# EAGLE schematic robot_PI4_F28379D (EAGLE 7.7.0)

## Sheet 1 of 6
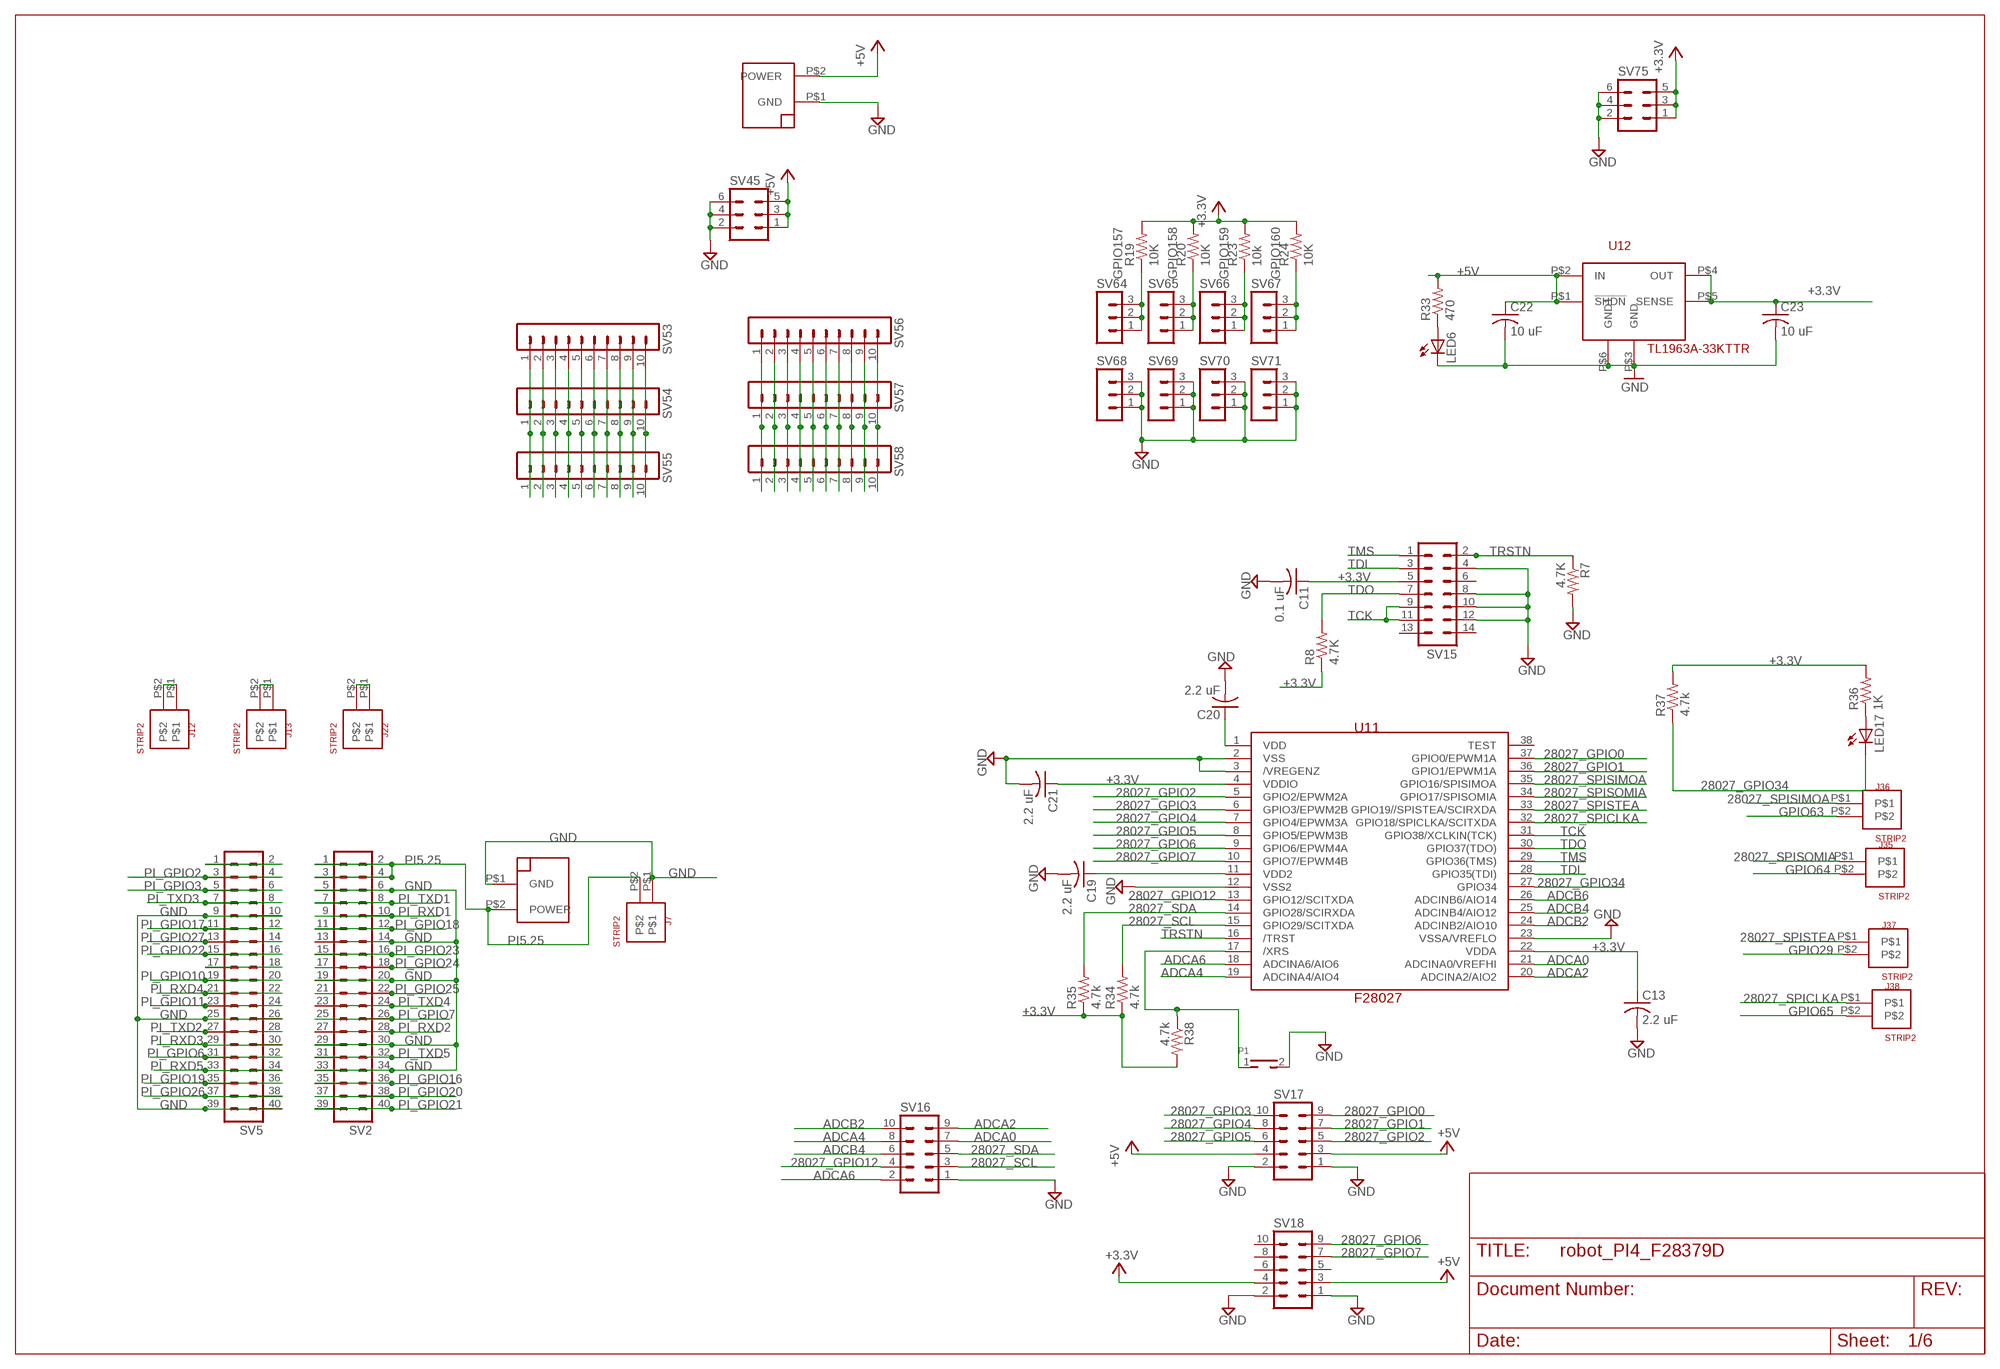
[diagram p0: schematic, sheet 1]

### Parts
C11  0.1 uF  C-USC1206  [C1206]
C13  2.2 uF  C-USC1206  [C1206]
C19  2.2 uF  C-USC1206  [C1206]
C20  2.2 uF  C-USC1206  [C1206]
C21  2.2 uF  C-USC1206  [C1206]
C22  10 uF  C-USC1206  [C1206]
C23  10 uF  C-USC1206  [C1206]
J7  STRIP2  [STRIP2]
J12  STRIP2  [STRIP2]
J13  STRIP2  [STRIP2]
J22  STRIP2  [STRIP2]
J35  STRIP2  [STRIP2]
J36  STRIP2  [STRIP2]
J37  STRIP2  [STRIP2]
J38  STRIP2  [STRIP2]
LED6  LEDCHIPLED_1206  [CHIPLED_1206]
LED17  LEDCHIPLED_1206  [CHIPLED_1206]
P1  TH_PUSHBOTTON  [TH_PUSHBUTTON]
P2  MOLEX_POWER  [MOLEX_POWER]
P3  MOLEX_POWER  [MOLEX_POWER]
R7  4.7K  R-US_M1206  [M1206]
R8  4.7K  R-US_M1206  [M1206]
R19  10K  R-US_M1206  [M1206]
R20  10K  R-US_M1206  [M1206]
R23  10k  R-US_M1206  [M1206]
R24  10K  R-US_M1206  [M1206]
R33  470  R-US_M1206  [M1206]
R34  4.7k  R-US_M1206  [M1206]
R35  4.7k  R-US_M1206  [M1206]
R36  1K  R-US_M1206  [M1206]
R37  4.7k  R-US_M1206  [M1206]
R38  4.7k  R-US_M1206  [M1206]
SV2  MA20-2  [MA20-2]
SV5  MA20-2  [MA20-2]
SV15  MA07-2  [MA07-2]
SV16  MA05-2  [MA05-2]
SV17  MA05-2  [MA05-2]
SV18  MA05-2  [MA05-2]
SV45  MA03-2  [MA03-2]
SV53  MA10-1  [MA10-1]
SV54  MA10-1  [MA10-1]
SV55  MA10-1  [MA10-1]
SV56  MA10-1  [MA10-1]
SV57  MA10-1  [MA10-1]
SV58  MA10-1  [MA10-1]
SV64  MA03-1  [MA03-1]
SV65  MA03-1  [MA03-1]
SV66  MA03-1  [MA03-1]
SV67  MA03-1  [MA03-1]
SV68  MA03-1  [MA03-1]
SV69  MA03-1  [MA03-1]
SV70  MA03-1  [MA03-1]
SV71  MA03-1  [MA03-1]
SV75  MA03-2  [MA03-2]
U11  F28027  TMS320F28027DAS  [DA38]
U12  TL1963A-33KTTR  [TL1963AKTTR]

### Nets
28027_GPIO0: SV17.9 U11.37(GPIO0/EPWM1A)
28027_GPIO1: SV17.7 U11.36(GPIO1/EPWM1A)
28027_GPIO2: SV17.5 U11.5(GPIO2/EPWM2A)
28027_GPIO3: SV17.10 U11.6(GPIO3/EPWM2B)
28027_GPIO4: SV17.8 U11.7(GPIO4/EPWM3A)
28027_GPIO5: SV17.6 U11.8(GPIO5/EPWM3B)
28027_GPIO6: SV18.9 U11.9(GPIO6/EPWM4A)
28027_GPIO7: SV18.7 U11.10(GPIO7/EPWM4B)
28027_GPIO12: SV16.4 U11.13(GPIO12/SCITXDA)
28027_GPIO34: LED17.C R37.1 U11.27(GPIO34)
28027_SCL: R34.2 SV16.3 U11.15(GPIO29/SCITXDA)
28027_SDA: R35.2 SV16.5 U11.14(GPIO28/SCIRXDA)
28027_SPICLKA: J38.P$1 U11.32(GPIO18/SPICLKA/SCITXDA)
28027_SPISIMOA: J36.P$1 U11.35(GPIO16/SPISIMOA)
28027_SPISOMIA: J35.P$1 U11.34(GPIO17/SPISOMIA)
28027_SPISTEA: J37.P$1 U11.33(GPIO19//SPISTEA/SCIRXDA)
+3.3V [supply]: C11.1 C13.1 C21.1 C23.1 R8.1 R19.2 R20.2 R23.2 R24.2 R34.1 R35.1 R36.2 R37.2 R38.2 SV15.5 SV18.4 SV75.1 SV75.3 SV75.5 U11.4(VDDIO) U11.22(VDDA) U12.P$4(OUT) U12.P$5(SENSE) ; also sheet 2,3,4,5,6
+5V [supply]: C22.1 P3.P$2(POWER) R33.2 SV17.3 SV17.4 SV18.3 SV45.1 SV45.3 SV45.5 U12.P$1(!SHDN) U12.P$2(IN) ; also sheet 4,5,6
ADCA0: SV16.7 U11.21(ADCINA0/VREFHI)
ADCA2: SV16.9 U11.20(ADCINA2/AIO2)
ADCA4: SV16.8 U11.19(ADCINA4/AIO4)
ADCA6: SV16.2 U11.18(ADCINA6/AIO6)
ADCB2: SV16.10 U11.24(ADCINB2/AIO10)
ADCB4: SV16.6 U11.25(ADCINB4/AIO12)
ADCB6: U11.26(ADCINB6/AIO14)
GND [supply]: C11.2 C13.2 C19.2 C20.2 C21.2 C22.2 C23.2 J7.P$1 LED6.C P1.2 P2.P$1(GND) P3.P$1(GND) R7.2 SV2.5 SV2.6 SV2.13 SV2.14 SV2.19 SV2.20 SV2.29 SV2.30 SV2.33 SV2.34 SV5.9 SV5.10 SV5.25 SV5.26 SV5.39 SV5.40 SV15.4 SV15.8 SV15.10 SV15.12 SV16.1 SV17.1 SV17.2 SV18.1 SV18.2 SV45.2 SV45.4 SV45.6 SV68.1 SV68.2 SV68.3 SV69.1 SV69.2 SV69.3 SV70.1 SV70.2 SV70.3 SV71.1 SV71.2 SV71.3 SV75.2 SV75.4 SV75.6 U11.2(VSS) U11.3(/VREGENZ) U11.12(VSS2) U11.23(VSSA/VREFLO) U12.P$3(GND) U12.P$6(GND1) ; also sheet 2,3,4,5,6
GPIO29: J37.P$2 ; also sheet 4
GPIO63: J36.P$2 ; also sheet 4,5,6
GPIO64: J35.P$2 ; also sheet 4,5,6
GPIO65: J38.P$2 ; also sheet 4,5,6
GPIO157: R19.1 SV64.1 SV64.2 SV64.3 ; also sheet 4
GPIO158: R20.1 SV65.1 SV65.2 SV65.3 ; also sheet 4
GPIO159: R23.1 SV66.1 SV66.2 SV66.3 ; also sheet 4
GPIO160: R24.1 SV67.1 SV67.2 SV67.3 ; also sheet 4
N$30 [supply]: SV5.1 SV5.2
N$38 [supply]: SV5.17 SV5.18
N$57: LED6.A R33.1
N$64 [supply]: J12.P$1 J12.P$2
N$65 [supply]: J13.P$1 J13.P$2
N$66 [supply]: J22.P$1 J22.P$2
N$67: SV53.1 SV54.1 SV55.1
N$69: SV53.2 SV54.2 SV55.2
N$73: SV53.3 SV54.3 SV55.3
N$77: SV53.4 SV54.4 SV55.4
N$78: SV53.5 SV54.5 SV55.5
N$79: SV53.6 SV54.6 SV55.6
N$80: SV53.7 SV54.7 SV55.7
N$81: SV53.8 SV54.8 SV55.8
N$82: SV53.9 SV54.9 SV55.9
N$83: SV53.10 SV54.10 SV55.10
N$84: SV56.1 SV57.1 SV58.1
N$85: SV56.2 SV57.2 SV58.2
N$86: SV56.3 SV57.3 SV58.3
N$87: SV56.4 SV57.4 SV58.4
N$88: SV56.5 SV57.5 SV58.5
N$89: SV56.6 SV57.6 SV58.6
N$90: SV56.7 SV57.7 SV58.7
N$91: SV56.8 SV57.8 SV58.8
N$92: SV56.9 SV57.9 SV58.9
N$93: SV56.10 SV57.10 SV58.10
N$103: C20.1 U11.1(VDD)
N$104: C19.1 U11.11(VDD2)
N$105: P1.1 R38.1 U11.17(/XRS)
N$106: LED17.A R36.1
PI5.25 [supply]: J7.P$2 P2.P$2(POWER) SV2.1 SV2.2 SV2.3 SV2.4
PI_GPIO2: SV5.3 SV5.4 ; also sheet 3
PI_GPIO3: SV5.5 SV5.6 ; also sheet 3
PI_GPIO6: SV5.31 SV5.32 ; also sheet 3
PI_GPIO7: SV2.25 SV2.26 ; also sheet 3
PI_GPIO10: SV5.19 SV5.20 ; also sheet 3
PI_GPIO11: SV5.23 SV5.24 ; also sheet 3
PI_GPIO16: SV2.35 SV2.36
PI_GPIO17: SV5.11 SV5.12
PI_GPIO18: SV2.11 SV2.12
PI_GPIO19: SV5.35 SV5.36
PI_GPIO20: SV2.37 SV2.38
PI_GPIO21: SV2.39 SV2.40
PI_GPIO22: SV5.15 SV5.16
PI_GPIO23: SV2.15 SV2.16
PI_GPIO24: SV2.17 SV2.18
PI_GPIO25: SV2.21 SV2.22
PI_GPIO26: SV5.37 SV5.38
PI_GPIO27: SV5.13 SV5.14
PI_RXD1: SV2.9 SV2.10 ; also sheet 3
PI_RXD2: SV2.27 SV2.28 ; also sheet 3
PI_RXD3: SV5.29 SV5.30 ; also sheet 3
PI_RXD4: SV5.21 SV5.22 ; also sheet 3
PI_RXD5: SV5.33 SV5.34 ; also sheet 3
PI_TXD1: SV2.7 SV2.8 ; also sheet 3
PI_TXD2: SV5.27 SV5.28 ; also sheet 3
PI_TXD3: SV5.7 SV5.8 ; also sheet 3
PI_TXD4: SV2.23 SV2.24 ; also sheet 3
PI_TXD5: SV2.31 SV2.32 ; also sheet 3
TCK: SV15.9 SV15.11 U11.31(GPIO38/XCLKIN(TCK))
TDI: SV15.3 U11.28(GPIO35(TDI))
TDO: R8.2 SV15.7 U11.30(GPIO37(TDO))
TMS: SV15.1 U11.29(GPIO36(TMS))
TRSTN: R7.1 SV15.2 U11.16(/TRST)
Unconnected: SV15.6 SV15.13 SV15.14 SV18.5 SV18.6 SV18.8 SV18.10 U11.38(TEST)

## Sheet 2 of 6
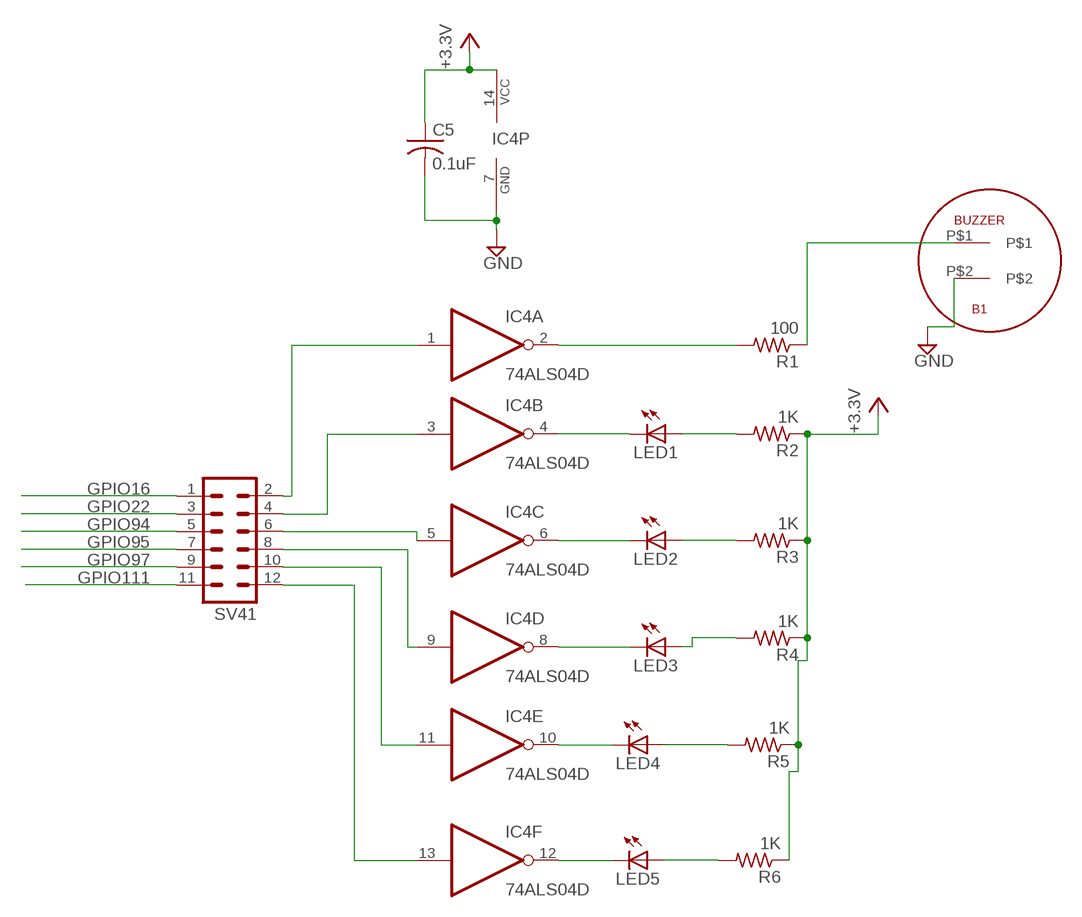
[diagram p1: schematic, sheet 2]

### Parts
B1  BUZZER  [BUZZER]
C5  0.1uF  C-USC0805  [C0805]
IC4  74ALS04D  [SO14]
LED1  LEDCHIPLED_1206  [CHIPLED_1206]
LED2  LEDCHIPLED_1206  [CHIPLED_1206]
LED3  LEDCHIPLED_1206  [CHIPLED_1206]
LED4  LEDCHIPLED_1206  [CHIPLED_1206]
LED5  LEDCHIPLED_1206  [CHIPLED_1206]
R1  100  R-US_R1206  [R1206]
R2  1K  R-US_R1206  [R1206]
R3  1K  R-US_R1206  [R1206]
R4  1K  R-US_R1206  [R1206]
R5  1K  R-US_R1206  [R1206]
R6  1K  R-US_R1206  [R1206]
SV41  MA06-2  [MA06-2]

### Nets
+3.3V [supply]: C5.1 IC4.14(P:VCC) R2.1 R3.1 R4.1 R5.1 R6.1 ; also sheet 1,3,4,5,6
GND [supply]: B1.P$2 C5.2 IC4.7(P:GND) ; also sheet 1,3,4,5,6
GPIO16: SV41.1 ; also sheet 4
GPIO22: SV41.3 ; also sheet 4
GPIO94: SV41.5 ; also sheet 4
GPIO95: SV41.7 ; also sheet 4
GPIO97: SV41.9 ; also sheet 4
GPIO111: SV41.11 ; also sheet 4
N$1: IC4.2(A:O) R1.2
N$2: IC4.4(B:O) LED1.C
N$3: B1.P$1 R1.1
N$4: LED1.A R2.2
N$5: LED2.A R3.2
N$6: LED3.A R4.2
N$7: LED4.A R5.2
N$8: LED5.A R6.2
N$9: IC4.12(F:O) LED5.C
N$10: IC4.10(E:O) LED4.C
N$11: IC4.8(D:O) LED3.C
N$12: IC4.6(C:O) LED2.C
N$13: IC4.1(A:I) SV41.2
N$14: IC4.3(B:I) SV41.4
N$15: IC4.5(C:I) SV41.6
N$16: IC4.9(D:I) SV41.8
N$17: IC4.11(E:I) SV41.10
N$18: IC4.13(F:I) SV41.12

## Sheet 3 of 6
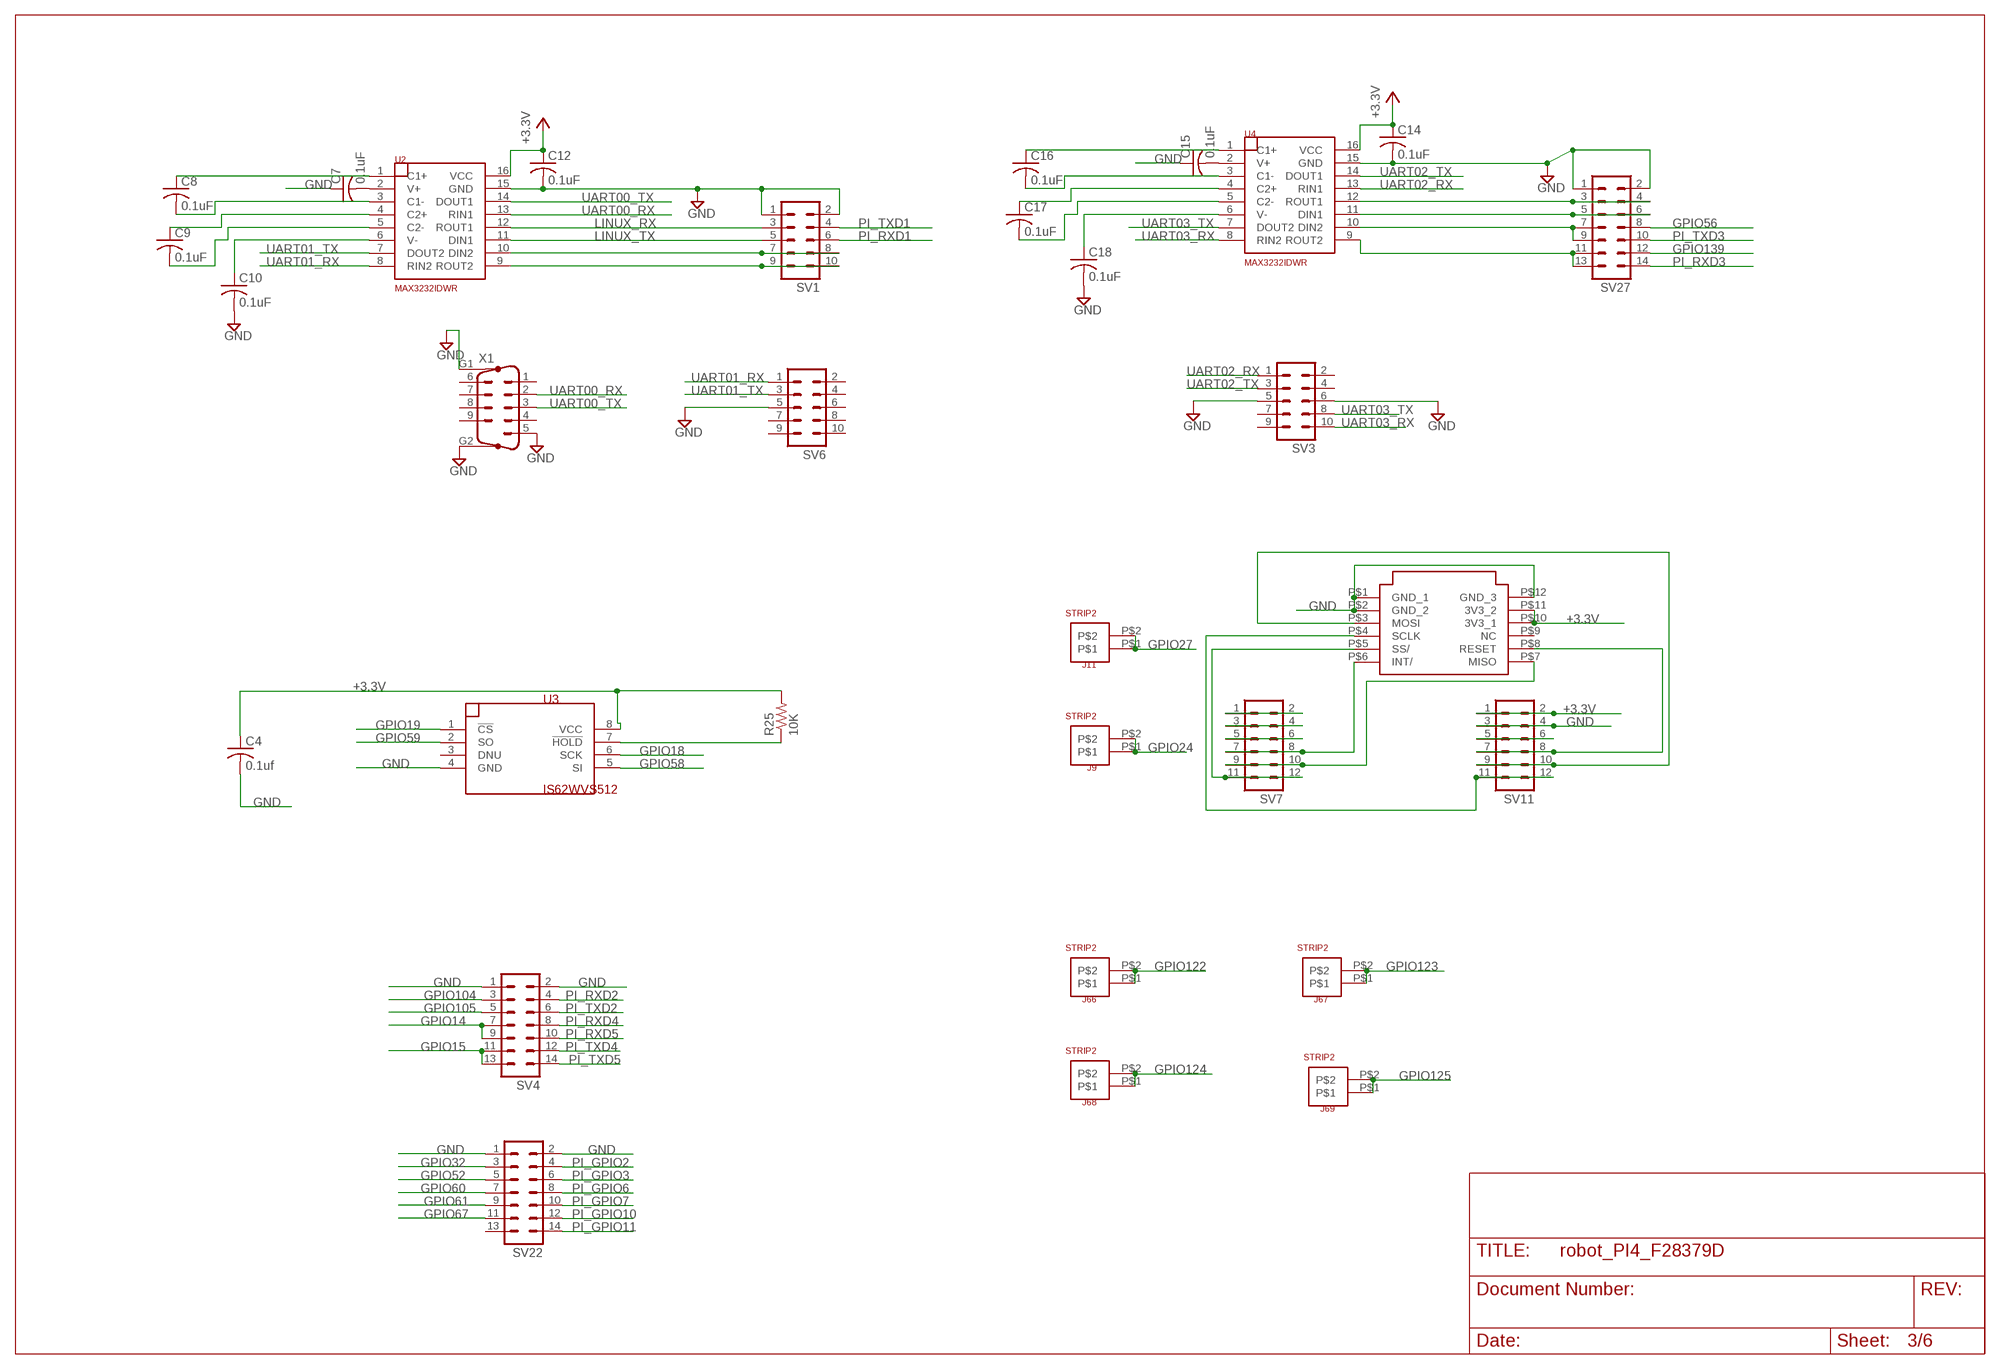
[diagram p2: schematic, sheet 3]

### Parts
C4  0.1uf  C-USC1206  [C1206]
C7  0.1uF  C-USC0805K  [C0805K]
C8  0.1uF  C-USC0805K  [C0805K]
C9  0.1uF  C-USC0805K  [C0805K]
C10  0.1uF  C-USC0805K  [C0805K]
C12  0.1uF  C-USC0805K  [C0805K]
C14  0.1uF  C-USC0805K  [C0805K]
C15  0.1uF  C-USC0805K  [C0805K]
C16  0.1uF  C-USC0805K  [C0805K]
C17  0.1uF  C-USC0805K  [C0805K]
C18  0.1uF  C-USC0805K  [C0805K]
ETH1  USR_ES1_W5500  [USR_ES1_W5500]
J9  STRIP2  [STRIP2]
J11  STRIP2  [STRIP2]
J66  STRIP2  [STRIP2]
J67  STRIP2  [STRIP2]
J68  STRIP2  [STRIP2]
J69  STRIP2  [STRIP2]
R25  10K  R-US_M1206  [M1206]
SV1  MA05-2  [MA05-2]
SV3  MA05-2  [MA05-2]
SV4  MA07-2  [MA07-2]
SV6  MA05-2  [MA05-2]
SV7  MA06-2  [MA06-2]
SV11  MA06-2  [MA06-2]
SV22  MA07-2  [MA07-2]
SV27  MA07-2  [MA07-2]
U2  MAX3232IDWR  [SO16W]
U3  IS62WVS512  [SO08]
U4  MAX3232IDWR  [SO16W]
X1  M09HP  [M09HP]

### Nets
+3.3V [supply]: C4.1 C12.1 C14.1 ETH1.P$10(3V3_1) ETH1.P$11(3V3_2) R25.2 SV11.1 SV11.2 U2.16(VCC) U3.8(VCC) U4.16(VCC) ; also sheet 1,2,4,5,6
GND [supply]: C4.2 C7.1 C10.2 C12.2 C14.2 C15.1 C18.2 ETH1.P$1(GND_1) ETH1.P$2(GND_2) ETH1.P$12(GND_3) SV1.1 SV1.2 SV3.5 SV3.6 SV4.1 SV4.2 SV6.5 SV11.3 SV11.4 SV22.1 SV22.2 SV27.1 SV27.2 U2.15(GND) U3.4(GND) U4.15(GND) X1.5 X1.G1 X1.G2 ; also sheet 1,2,4,5,6
GPIO14: SV4.7 SV4.9 ; also sheet 4
GPIO15: SV4.11 SV4.13 ; also sheet 4
GPIO18: U3.6(SCK) ; also sheet 4
GPIO19: U3.1(!CS) ; also sheet 4
GPIO24: J9.P$1 J9.P$2 ; also sheet 4
GPIO27: J11.P$1 J11.P$2 ; also sheet 4
GPIO32: SV22.3 ; also sheet 4
GPIO52: SV22.5 ; also sheet 4
GPIO56: SV27.8 ; also sheet 4
GPIO58: U3.5(SI) ; also sheet 4
GPIO59: U3.2(SO) ; also sheet 4
GPIO60: SV22.7 ; also sheet 4
GPIO61: SV22.9 ; also sheet 4
GPIO67: SV22.11 ; also sheet 4
GPIO104: SV4.3 ; also sheet 4
GPIO105: SV4.5 ; also sheet 4
GPIO122: J66.P$1 J66.P$2 ; also sheet 4
GPIO123: J67.P$1 J67.P$2 ; also sheet 4
GPIO124: J68.P$1 J68.P$2 ; also sheet 4
GPIO125: J69.P$1 J69.P$2 ; also sheet 4
GPIO139: SV27.12 ; also sheet 4
LINUX_RX: SV1.3 U2.12(ROUT1)
LINUX_TX: SV1.5 U2.11(DIN1)
N$19: SV1.7 SV1.8 U2.10(DIN2)
N$20: C7.2 U2.2(V+)
N$21: C16.1 U4.1(C1+)
N$22: C16.2 U4.3(C1-)
N$23: C17.1 U4.4(C2+)
N$24: C17.2 U4.5(C2-)
N$25: SV1.9 SV1.10 U2.9(ROUT2)
N$26: C18.1 U4.6(V-)
N$27: C15.2 U4.2(V+)
N$32: SV27.11 SV27.13 U4.9(ROUT2)
N$58: SV27.3 SV27.4 U4.12(ROUT1)
N$59: SV27.5 SV27.6 U4.11(DIN1)
N$60: SV27.7 SV27.9 U4.10(DIN2)
N$71: C8.1 U2.1(C1+)
N$72: C8.2 U2.3(C1-)
N$74: C9.1 U2.4(C2+)
N$75: C9.2 U2.5(C2-)
N$76: C10.1 U2.6(V-)
N$94: R25.1 U3.7(!HOLD)
N$95: SV7.1 SV7.2
N$96: SV7.3 SV7.4
N$97: SV7.5 SV7.6
N$98: ETH1.P$6(INT/) SV7.7 SV7.8
N$121: ETH1.P$7(MISO) SV7.9 SV7.10
N$135: ETH1.P$5(SS/) SV7.11 SV7.12
N$146: SV11.5 SV11.6
N$149: ETH1.P$8(RESET) SV11.7 SV11.8
N$154: ETH1.P$3(MOSI) SV11.9 SV11.10
N$155: ETH1.P$4(SCLK) SV11.11 SV11.12
PI_GPIO2: SV22.4 ; also sheet 1
PI_GPIO3: SV22.6 ; also sheet 1
PI_GPIO6: SV22.8 ; also sheet 1
PI_GPIO7: SV22.10 ; also sheet 1
PI_GPIO10: SV22.12 ; also sheet 1
PI_GPIO11: SV22.14 ; also sheet 1
PI_RXD1: SV1.6 ; also sheet 1
PI_RXD2: SV4.4 ; also sheet 1
PI_RXD3: SV27.14 ; also sheet 1
PI_RXD4: SV4.8 ; also sheet 1
PI_RXD5: SV4.10 ; also sheet 1
PI_TXD1: SV1.4 ; also sheet 1
PI_TXD2: SV4.6 ; also sheet 1
PI_TXD3: SV27.10 ; also sheet 1
PI_TXD4: SV4.12 ; also sheet 1
PI_TXD5: SV4.14 ; also sheet 1
UART00_RX: U2.13(RIN1) X1.2
UART00_TX: U2.14(DOUT1) X1.3
UART01_RX: SV6.1 U2.8(RIN2)
UART01_TX: SV6.3 U2.7(DOUT2)
UART02_RX: SV3.1 U4.13(RIN1)
UART02_TX: SV3.3 U4.14(DOUT1)
UART03_RX: SV3.10 U4.8(RIN2)
UART03_TX: SV3.8 U4.7(DOUT2)
Unconnected: ETH1.P$9(NC) SV3.2 SV3.4 SV3.7 SV3.9 SV6.2 SV6.4 SV6.6 SV6.7 SV6.8 SV6.9 SV6.10 SV22.13 U3.3(DNU) X1.1 X1.4 X1.6 X1.7 X1.8 X1.9

## Sheet 4 of 6
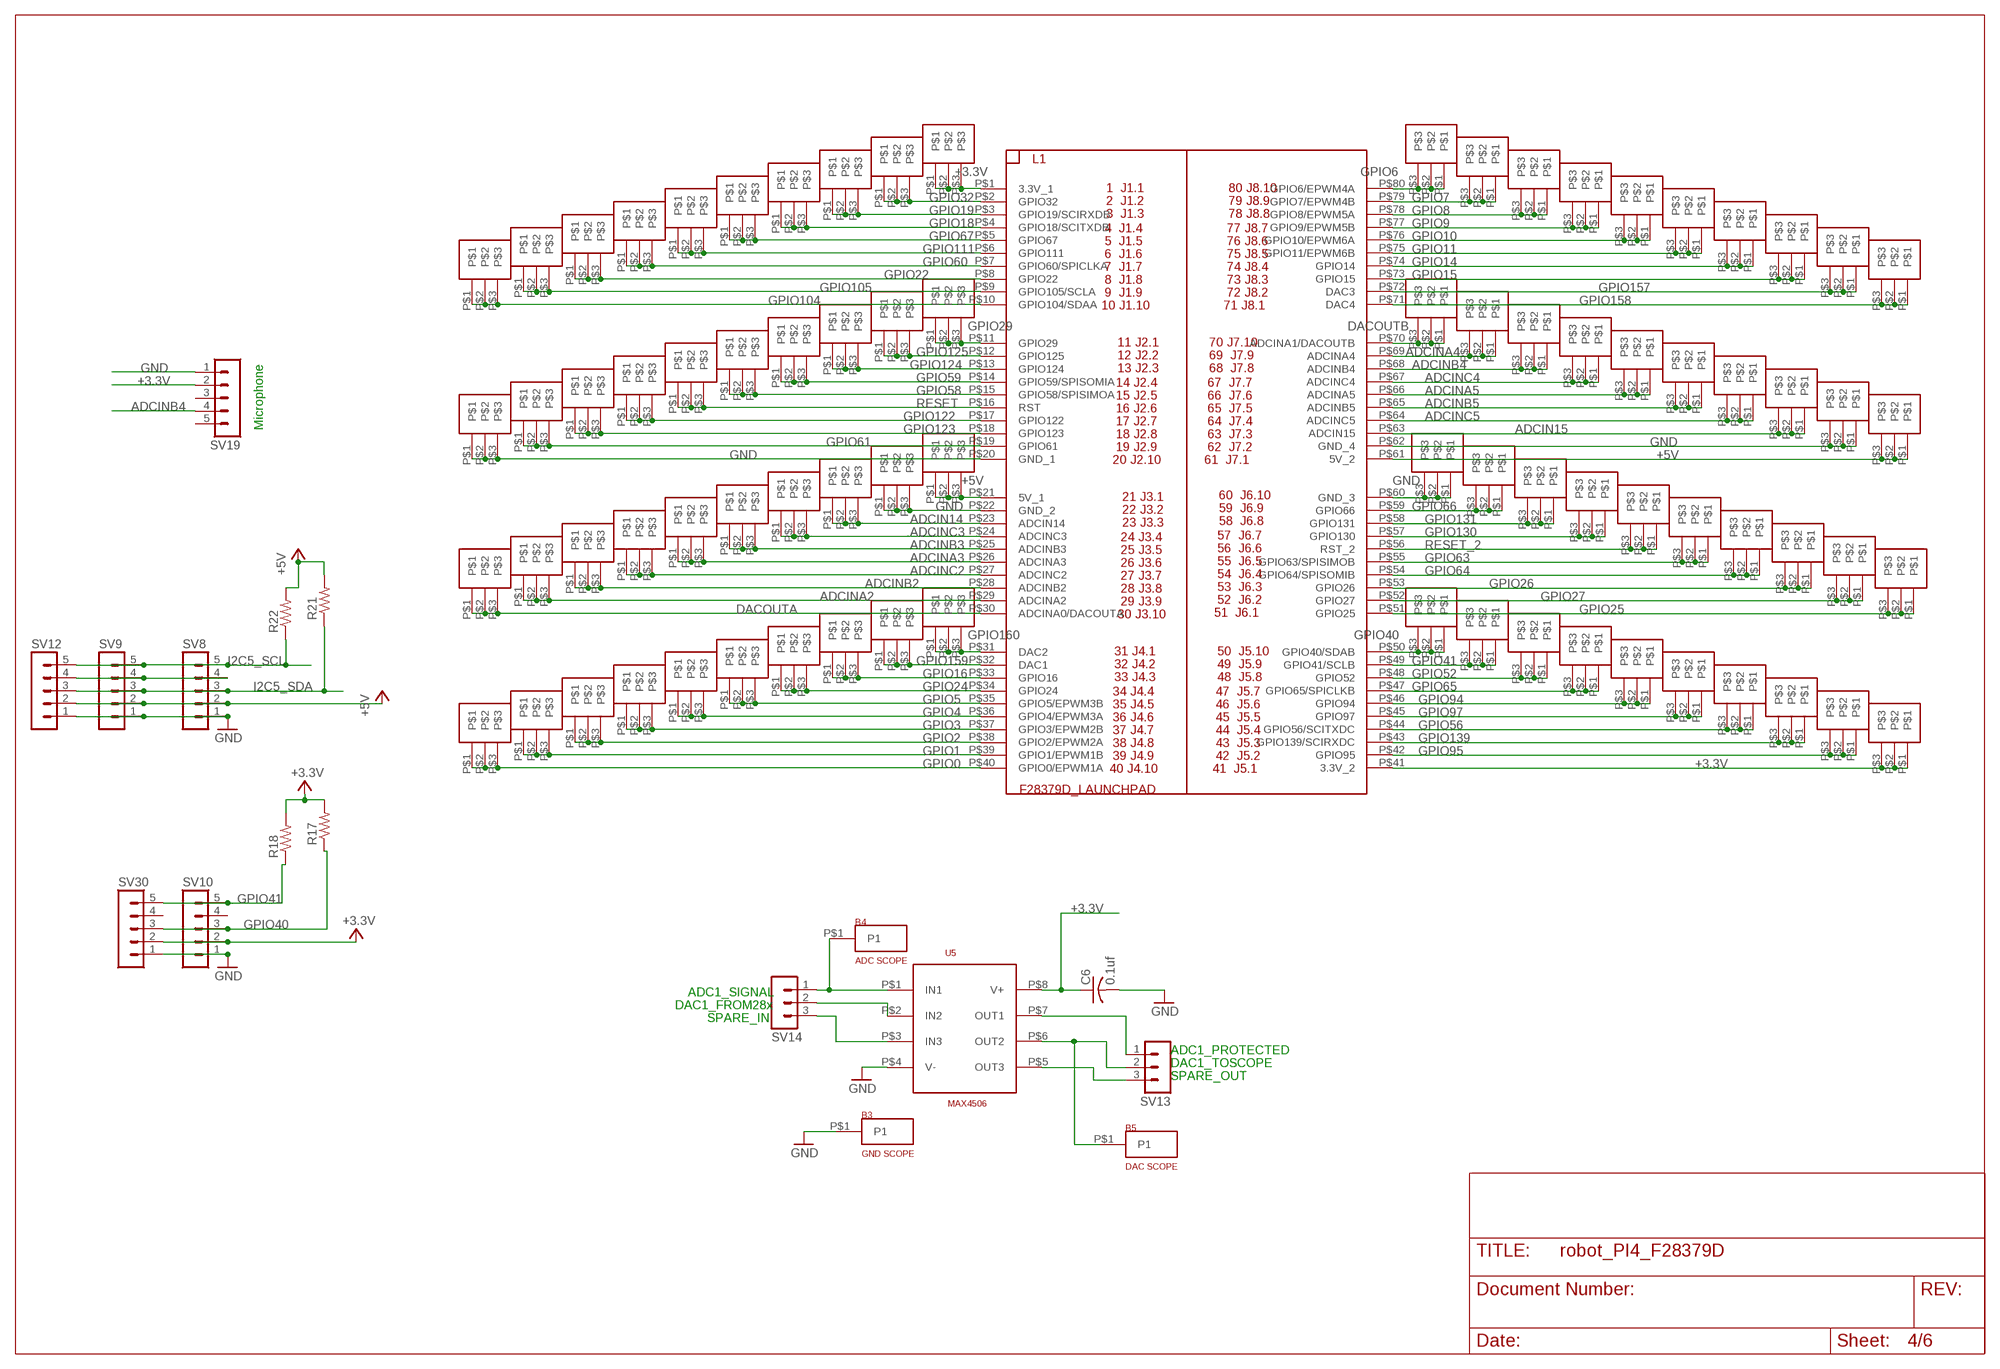
[diagram p3: schematic, sheet 4]

### Parts
B3  GND SCOPE  BANANA_MALE  [BANANA_MALE]
B4  ADC SCOPE  BANANA_MALE  [BANANA_MALE]
B5  DAC SCOPE  BANANA_MALE  [BANANA_MALE]
C6  0.1uf  C-USC1206  [C1206]
J10  STRIP3  [STRIP3]
J14  STRIP3  [STRIP3]
J15  STRIP3  [STRIP3]
J16  STRIP3  [STRIP3]
J17  STRIP3  [STRIP3]
J18  STRIP3  [STRIP3]
J19  STRIP3  [STRIP3]
J20  STRIP3  [STRIP3]
J21  STRIP3  [STRIP3]
J28  STRIP3  [STRIP3]
J29  STRIP3  [STRIP3]
J30  STRIP3  [STRIP3]
J31  STRIP3  [STRIP3]
J32  STRIP3  [STRIP3]
J33  STRIP3  [STRIP3]
J98  STRIP3  [STRIP3]
J99  STRIP3  [STRIP3]
J100  STRIP3  [STRIP3]
J101  STRIP3  [STRIP3]
J102  STRIP3  [STRIP3]
J103  STRIP3  [STRIP3]
J104  STRIP3  [STRIP3]
J105  STRIP3  [STRIP3]
J106  STRIP3  [STRIP3]
J107  STRIP3  [STRIP3]
J108  STRIP3  [STRIP3]
J109  STRIP3  [STRIP3]
J110  STRIP3  [STRIP3]
J111  STRIP3  [STRIP3]
J112  STRIP3  [STRIP3]
J113  STRIP3  [STRIP3]
J114  STRIP3  [STRIP3]
J115  STRIP3  [STRIP3]
J116  STRIP3  [STRIP3]
J117  STRIP3  [STRIP3]
J118  STRIP3  [STRIP3]
J119  STRIP3  [STRIP3]
J120  STRIP3  [STRIP3]
J121  STRIP3  [STRIP3]
J122  STRIP3  [STRIP3]
J133  STRIP3  [STRIP3]
J134  STRIP3  [STRIP3]
J135  STRIP3  [STRIP3]
J136  STRIP3  [STRIP3]
J137  STRIP3  [STRIP3]
J138  STRIP3  [STRIP3]
J139  STRIP3  [STRIP3]
J140  STRIP3  [STRIP3]
J141  STRIP3  [STRIP3]
J142  STRIP3  [STRIP3]
J143  STRIP3  [STRIP3]
J144  STRIP3  [STRIP3]
J145  STRIP3  [STRIP3]
J146  STRIP3  [STRIP3]
J147  STRIP3  [STRIP3]
J148  STRIP3  [STRIP3]
J149  STRIP3  [STRIP3]
J150  STRIP3  [STRIP3]
J151  STRIP3  [STRIP3]
J152  STRIP3  [STRIP3]
J153  STRIP3  [STRIP3]
J154  STRIP3  [STRIP3]
J155  STRIP3  [STRIP3]
J156  STRIP3  [STRIP3]
J157  STRIP3  [STRIP3]
J158  STRIP3  [STRIP3]
J159  STRIP3  [STRIP3]
J160  STRIP3  [STRIP3]
J161  STRIP3  [STRIP3]
J162  STRIP3  [STRIP3]
J163  STRIP3  [STRIP3]
J164  STRIP3  [STRIP3]
J165  STRIP3  [STRIP3]
J166  STRIP3  [STRIP3]
J167  STRIP3  [STRIP3]
J168  STRIP3  [STRIP3]
J169  STRIP3  [STRIP3]
J170  STRIP3  [STRIP3]
J176  STRIP3  [STRIP3]
J177  STRIP3  [STRIP3]
L1  F28379D_LAUNCHPAD  [F28379D_LAUNCHPAD]
R17  R-US_R1206  [R1206]
R18  R-US_R1206  [R1206]
R21  R-US_R1206  [R1206]
R22  R-US_R1206  [R1206]
SV8  MA05-1  [MA05-1]
SV9  MA05-1  [MA05-1]
SV10  MA05-1  [MA05-1]
SV12  MA05-1  [MA05-1]
SV13  MA03-1  [MA03-1]
SV14  MA03-1  [MA03-1]
SV19  MA05-1  [MA05-1]
SV30  MA05-1  [MA05-1]
U5  MAX4506  MAX4506-SOIC8  [SOIC-8]

### Nets
+3.3V [supply]: C6.1 J10.P$1 J10.P$2 J10.P$3 J177.P$1 J177.P$2 J177.P$3 L1.P$1(3.3V_1) L1.P$41(3.3V_2) R17.2 R18.2 SV10.2 SV19.2 SV30.2 U5.P$8(V+) ; also sheet 1,2,3,5,6
+5V [supply]: J103.P$1 J103.P$2 J103.P$3 J152.P$1 J152.P$2 J152.P$3 L1.P$21(5V_1) L1.P$61(5V_2) R21.2 R22.2 SV8.2 SV9.2 SV12.2 ; also sheet 1,5,6
ADCIN14: J105.P$1 J105.P$2 J105.P$3 L1.P$23(ADCIN14)
ADCIN15: J150.P$1 J150.P$2 J150.P$3 L1.P$63(ADCIN15)
ADCINA2: J111.P$1 J111.P$2 J111.P$3 L1.P$29(ADCINA2)
ADCINA3: J108.P$1 J108.P$2 J108.P$3 L1.P$26(ADCINA3)
ADCINA4: J144.P$1 J144.P$2 J144.P$3 L1.P$69(ADCINA4)
ADCINA5: J147.P$1 J147.P$2 J147.P$3 L1.P$66(ADCINA5)
ADCINB2: J110.P$1 J110.P$2 J110.P$3 L1.P$28(ADCINB2)
ADCINB3: J107.P$1 J107.P$2 J107.P$3 L1.P$25(ADCINB3)
ADCINB4: J145.P$1 J145.P$2 J145.P$3 L1.P$68(ADCINB4) SV19.4
ADCINB5: J148.P$1 J148.P$2 J148.P$3 L1.P$65(ADCINB5)
ADCINC2: J109.P$1 J109.P$2 J109.P$3 L1.P$27(ADCINC2) ; also sheet 5
ADCINC3: J106.P$1 J106.P$2 J106.P$3 L1.P$24(ADCINC3) ; also sheet 5
ADCINC4: J146.P$1 J146.P$2 J146.P$3 L1.P$67(ADCINC4) ; also sheet 5
ADCINC5: J149.P$1 J149.P$2 J149.P$3 L1.P$64(ADCINC5) ; also sheet 5
DACOUTA: J112.P$1 J112.P$2 J112.P$3 L1.P$30(ADCINA0/DACOUTA)
DACOUTB: J143.P$1 J143.P$2 J143.P$3 L1.P$70(ADCINA1/DACOUTB)
GND [supply]: B3.P$1(P1) C6.2 J102.P$1 J102.P$2 J102.P$3 J104.P$1 J104.P$2 J104.P$3 J151.P$1 J151.P$2 J151.P$3 J153.P$1 J153.P$2 J153.P$3 L1.P$20(GND_1) L1.P$22(GND_2) L1.P$60(GND_3) L1.P$62(GND_4) SV8.1 SV9.1 SV10.1 SV12.1 SV19.1 SV30.1 U5.P$4(V-) ; also sheet 1,2,3,5,6
GPIO0: J122.P$1 J122.P$2 J122.P$3 L1.P$40(GPIO0/EPWM1A) ; also sheet 6
GPIO1: J121.P$1 J121.P$2 J121.P$3 L1.P$39(GPIO1/EPWM1B) ; also sheet 6
GPIO2: J120.P$1 J120.P$2 J120.P$3 L1.P$38(GPIO2/EPWM2A) ; also sheet 6
GPIO3: J119.P$1 J119.P$2 J119.P$3 L1.P$37(GPIO3/EPWM2B) ; also sheet 6
GPIO4: J118.P$1 J118.P$2 J118.P$3 L1.P$36(GPIO4/EPWM3A) ; also sheet 6
GPIO5: J117.P$1 J117.P$2 J117.P$3 L1.P$35(GPIO5/EPWM3B) ; also sheet 6
GPIO6: J133.P$1 J133.P$2 J133.P$3 L1.P$80(GPIO6/EPWM4A) ; also sheet 6
GPIO7: J134.P$1 J134.P$2 J134.P$3 L1.P$79(GPIO7/EPWM4B) ; also sheet 6
GPIO8: J135.P$1 J135.P$2 J135.P$3 L1.P$78(GPIO8/EPWM5A) ; also sheet 6
GPIO9: J136.P$1 J136.P$2 J136.P$3 L1.P$77(GPIO9/EPWM5B) ; also sheet 6
GPIO10: J137.P$1 J137.P$2 J137.P$3 L1.P$76(GPIO10/EPWM6A) ; also sheet 6
GPIO11: J138.P$1 J138.P$2 J138.P$3 L1.P$75(GPIO11/EPWM6B)
GPIO14: J139.P$1 J139.P$2 J139.P$3 L1.P$74(GPIO14) ; also sheet 3
GPIO15: J140.P$1 J140.P$2 J140.P$3 L1.P$73(GPIO15) ; also sheet 3
GPIO16: J115.P$1 J115.P$2 J115.P$3 L1.P$33(GPIO16) ; also sheet 2
GPIO18: J16.P$1 J16.P$2 J16.P$3 L1.P$4(GPIO18/SCITXDB) ; also sheet 3
GPIO19: J15.P$1 J15.P$2 J15.P$3 L1.P$3(GPIO19/SCIRXDB) ; also sheet 3
GPIO22: J20.P$1 J20.P$2 J20.P$3 L1.P$8(GPIO22) ; also sheet 2
GPIO24: J116.P$1 J116.P$2 J116.P$3 L1.P$34(GPIO24) ; also sheet 3
GPIO25: J162.P$1 J162.P$2 J162.P$3 L1.P$51(GPIO25) ; also sheet 6
GPIO26: J160.P$1 J160.P$2 J160.P$3 L1.P$53(GPIO26) ; also sheet 6
GPIO27: J161.P$1 J161.P$2 J161.P$3 L1.P$52(GPIO27) ; also sheet 3
GPIO29: J29.P$1 J29.P$2 J29.P$3 L1.P$11(GPIO29) ; also sheet 1
GPIO32: J14.P$1 J14.P$2 J14.P$3 L1.P$2(GPIO32) ; also sheet 3
GPIO40: J163.P$1 J163.P$2 J163.P$3 L1.P$50(GPIO40/SDAB) R17.1 SV10.3 SV30.3
GPIO41: J164.P$1 J164.P$2 J164.P$3 L1.P$49(GPIO41/SCLB) R18.1 SV10.5 SV30.5
GPIO52: J165.P$1 J165.P$2 J165.P$3 L1.P$48(GPIO52) ; also sheet 3
GPIO56: J169.P$1 J169.P$2 J169.P$3 L1.P$44(GPIO56/SCITXDC) ; also sheet 3
GPIO58: J33.P$1 J33.P$2 J33.P$3 L1.P$15(GPIO58/SPISIMOA) ; also sheet 3
GPIO59: J32.P$1 J32.P$2 J32.P$3 L1.P$14(GPIO59/SPISOMIA) ; also sheet 3
GPIO60: J19.P$1 J19.P$2 J19.P$3 L1.P$7(GPIO60/SPICLKA) ; also sheet 3
GPIO61: J101.P$1 J101.P$2 J101.P$3 L1.P$19(GPIO61) ; also sheet 3
GPIO63: J158.P$1 J158.P$2 J158.P$3 L1.P$55(GPIO63/SPISIMOB) ; also sheet 1,5,6
GPIO64: J159.P$1 J159.P$2 J159.P$3 L1.P$54(GPIO64/SPISOMIB) ; also sheet 1,5,6
GPIO65: J166.P$1 J166.P$2 J166.P$3 L1.P$47(GPIO65/SPICLKB) ; also sheet 1,5,6
GPIO66: J154.P$1 J154.P$2 J154.P$3 L1.P$59(GPIO66) ; also sheet 5
GPIO67: J17.P$1 J17.P$2 J17.P$3 L1.P$5(GPIO67) ; also sheet 3
GPIO94: J167.P$1 J167.P$2 J167.P$3 L1.P$46(GPIO94) ; also sheet 2
GPIO95: J176.P$1 J176.P$2 J176.P$3 L1.P$42(GPIO95) ; also sheet 2
GPIO97: J168.P$1 J168.P$2 J168.P$3 L1.P$45(GPIO97) ; also sheet 2
GPIO104: J28.P$1 J28.P$2 J28.P$3 L1.P$10(GPIO104/SDAA) ; also sheet 3
GPIO105: J21.P$1 J21.P$2 J21.P$3 L1.P$9(GPIO105/SCLA) ; also sheet 3
GPIO111: J18.P$1 J18.P$2 J18.P$3 L1.P$6(GPIO111) ; also sheet 2
GPIO122: J99.P$1 J99.P$2 J99.P$3 L1.P$17(GPIO122) ; also sheet 3
GPIO123: J100.P$1 J100.P$2 J100.P$3 L1.P$18(GPIO123) ; also sheet 3
GPIO124: J31.P$1 J31.P$2 J31.P$3 L1.P$13(GPIO124) ; also sheet 3
GPIO125: J30.P$1 J30.P$2 J30.P$3 L1.P$12(GPIO125) ; also sheet 3
GPIO130: J156.P$1 J156.P$2 J156.P$3 L1.P$57(GPIO130) ; also sheet 6
GPIO131: J155.P$1 J155.P$2 J155.P$3 L1.P$58(GPIO131) ; also sheet 6
GPIO139: J170.P$1 J170.P$2 J170.P$3 L1.P$43(GPIO139/SCIRXDC) ; also sheet 3
GPIO157: J141.P$1 J141.P$2 J141.P$3 L1.P$72(DAC3) ; also sheet 1
GPIO158: J142.P$1 J142.P$2 J142.P$3 L1.P$71(DAC4) ; also sheet 1
GPIO159: J114.P$1 J114.P$2 J114.P$3 L1.P$32(DAC1) ; also sheet 1
GPIO160: J113.P$1 J113.P$2 J113.P$3 L1.P$31(DAC2) ; also sheet 1
I2C5_SCL: R22.1 SV8.5 SV9.5 SV12.5
I2C5_SDA: R21.1 SV8.3 SV9.3 SV12.3
N$28: SV8.4 SV9.4 SV12.4
N$29: SV13.1 U5.P$7(OUT1)
N$31: B5.P$1(P1) SV13.2 U5.P$6(OUT2)
N$99: SV13.3 U5.P$5(OUT3)
N$100: B4.P$1(P1) SV14.1 U5.P$1(IN1)
N$101: SV14.2 U5.P$2(IN2)
N$102: SV14.3 U5.P$3(IN3)
RESET: J98.P$1 J98.P$2 J98.P$3 L1.P$16(RST)
RESET_2: J157.P$1 J157.P$2 J157.P$3 L1.P$56(RST_2)
Unconnected: SV10.4 SV19.3 SV19.5 SV30.4

### Notes on the sheet
- Microphone
- ADC1_SIGNAL
- DAC1_FROM28x
- SPARE_IN
- ADC1_PROTECTED
- DAC1_TOSCOPE
- SPARE_OUT

## Sheet 5 of 6
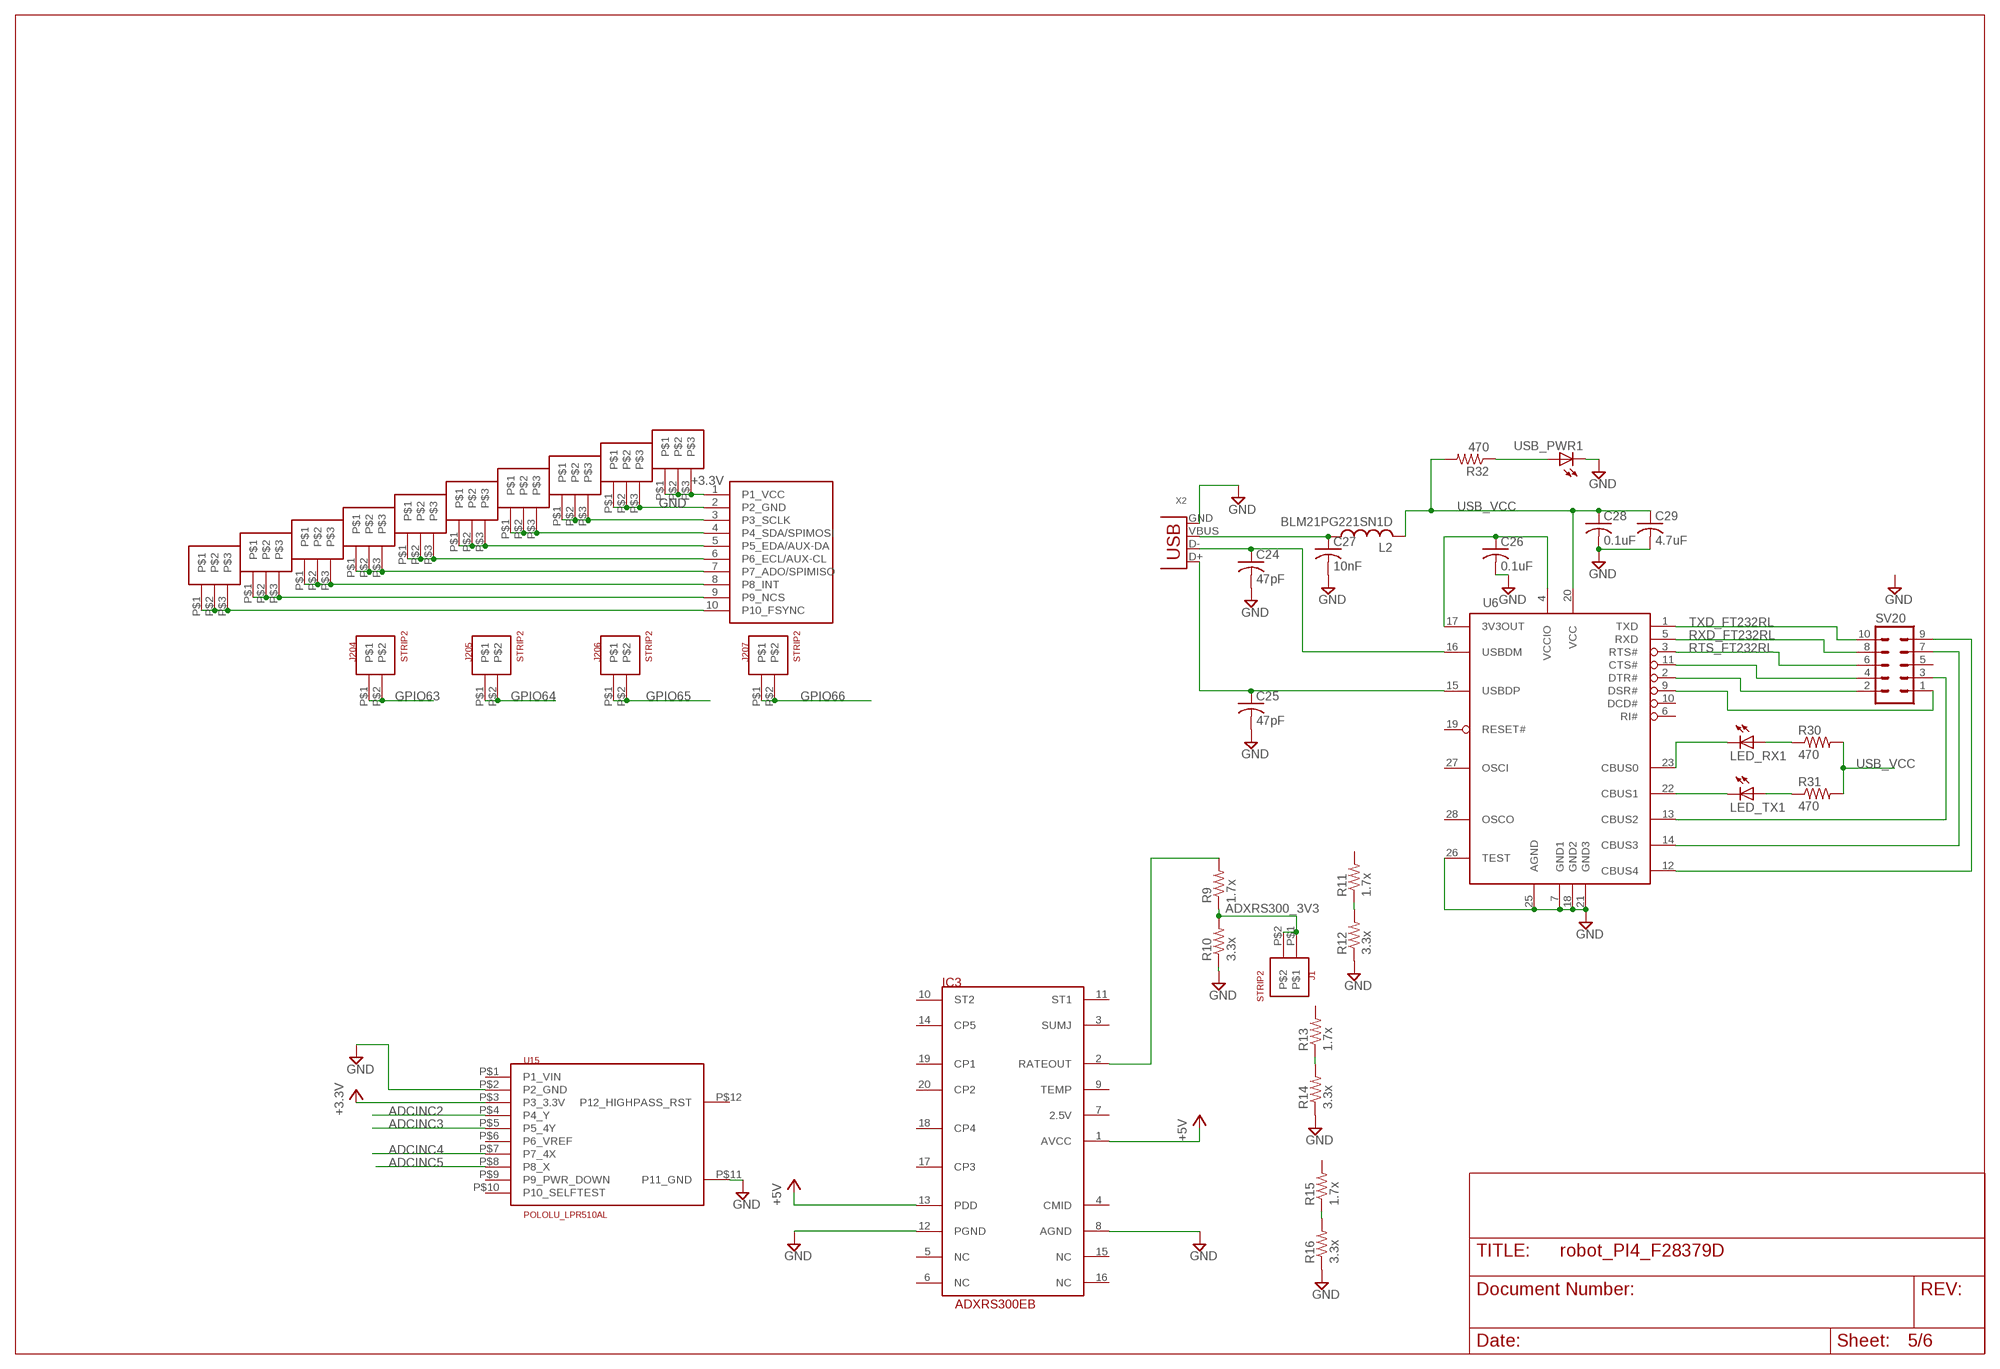
[diagram p4: schematic, sheet 5]

### Parts
C24  47pF  C-USC1206  [C1206]
C25  47pF  C-USC1206  [C1206]
C26  0.1uF  C-USC1206  [C1206]
C27  10nF  C-USC1206  [C1206]
C28  0.1uF  C-USC1206  [C1206]
C29  4.7uF  C-USC1206  [C1206]
IC3  ADXRS300EB  [DIL20]
J1  STRIP2  [STRIP2]
J123  STRIP3  [STRIP3]
J124  STRIP3  [STRIP3]
J125  STRIP3  [STRIP3]
J126  STRIP3  [STRIP3]
J127  STRIP3  [STRIP3]
J128  STRIP3  [STRIP3]
J129  STRIP3  [STRIP3]
J130  STRIP3  [STRIP3]
J131  STRIP3  [STRIP3]
J132  STRIP3  [STRIP3]
J204  STRIP2  [STRIP2]
J205  STRIP2  [STRIP2]
J206  STRIP2  [STRIP2]
J207  STRIP2  [STRIP2]
L2  BLM21PG221SN1D  L-USL0805  [L0805]
LED_RX1  LED3MM  [LED3MM]
LED_TX1  LED3MM  [LED3MM]
R9  1.7x  R-US_M1206  [M1206]
R10  3.3x  R-US_M1206  [M1206]
R11  1.7x  R-US_M1206  [M1206]
R12  3.3x  R-US_M1206  [M1206]
R13  1.7x  R-US_M1206  [M1206]
R14  3.3x  R-US_M1206  [M1206]
R15  1.7x  R-US_M1206  [M1206]
R16  3.3x  R-US_M1206  [M1206]
R30  470  R-US_M1206  [M1206]
R31  470  R-US_M1206  [M1206]
R32  470  R-US_M1206  [M1206]
SV20  MA05-2  [MA05-2]
U6  FT232RL  [SSOP28DB]
U15  POLOLU_LPR510AL  [POLOLU_LPR510AL]
U$1  MPU-9250-BB  [MPU-9250-BB]
USB_PWR1  LED3MM  [LED3MM]
X2  USB-B-H  [USB-B-H]

### Nets
+3.3V [supply]: J123.P$1 J123.P$2 J123.P$3 U15.P$3(P3_3.3V) U$1.1(P1_VCC) ; also sheet 1,2,3,4,6
+5V [supply]: IC3.1(AVCC) IC3.13(PDD) ; also sheet 1,4,6
ADCINC2: U15.P$4(P4_Y) ; also sheet 4
ADCINC3: U15.P$5(P5_4Y) ; also sheet 4
ADCINC4: U15.P$7(P7_4X) ; also sheet 4
ADCINC5: U15.P$8(P8_X) ; also sheet 4
ADXRS300_3V3: J1.P$1 J1.P$2 R9.1 R10.2
GND [supply]: C24.2 C25.2 C26.2 C27.2 C28.2 C29.2 IC3.8(AGND) IC3.12(PGND) J124.P$1 J124.P$2 J124.P$3 R10.1 R12.1 R14.1 R16.1 U6.7(GND1) U6.18(GND2) U6.21(GND3) U6.25(AGND) U6.26(TEST) U15.P$2(P2_GND) U15.P$11(P11_GND) U$1.2(P2_GND) USB_PWR1.K(C) X2.GND ; also sheet 1,2,3,4,6
GPIO63: J204.P$1 J204.P$2 ; also sheet 1,4,6
GPIO64: J205.P$1 J205.P$2 ; also sheet 1,4,6
GPIO65: J206.P$1 J206.P$2 ; also sheet 1,4,6
GPIO66: J207.P$1 J207.P$2 ; also sheet 4
N$39 [supply]: C27.1 L2.1 X2.VBUS
N$40: C24.1 U6.16(USBDM) X2.D-
N$41: C25.1 U6.15(USBDP) X2.D+
N$42: C26.1 U6.4(VCCIO) U6.17(3V3OUT)
N$43: LED_TX1.K(C) U6.22(CBUS1)
N$44: LED_RX1.K(C) U6.23(CBUS0)
N$45: LED_RX1.A R30.1
N$46: LED_TX1.A R31.1
N$47: SV20.4 U6.11(CTS#)
N$48: SV20.2 U6.2(DTR#)
N$49: SV20.1 U6.9(DSR#)
N$50: R11.1 R12.2
N$51: R13.1 R14.2
N$52: SV20.3 U6.13(CBUS2)
N$53: SV20.7 U6.14(CBUS3)
N$54: SV20.9 U6.12(CBUS4)
N$55: R32.1 USB_PWR1.A
N$68: R15.1 R16.2
N$70: IC3.2(RATEOUT) R9.2
N$335 [supply]: J125.P$1 J125.P$2 J125.P$3 U$1.3(P3_SCLK)
N$336 [supply]: J126.P$1 J126.P$2 J126.P$3 U$1.4(P4_SDA/SPIMOSI)
N$337 [supply]: J127.P$1 J127.P$2 J127.P$3 U$1.5(P5_EDA/AUX-DA)
N$338 [supply]: J128.P$1 J128.P$2 J128.P$3 U$1.6(P6_ECL/AUX-CL)
N$339 [supply]: J129.P$1 J129.P$2 J129.P$3 U$1.7(P7_ADO/SPIMISO)
N$340 [supply]: J130.P$1 J130.P$2 J130.P$3 U$1.8(P8_INT)
N$341 [supply]: J131.P$1 J131.P$2 J131.P$3 U$1.9(P9_NCS)
N$342 [supply]: J132.P$1 J132.P$2 J132.P$3 U$1.10(P10_FSYNC)
RTS_FT232RL: SV20.6 U6.3(RTS#)
RXD_FT232RL: SV20.8 U6.5(RXD)
TXD_FT232RL: SV20.10 U6.1(TXD)
USB_VCC [supply]: C28.1 C29.1 L2.2 R30.2 R31.2 R32.2 U6.20(VCC)
Unconnected: IC3.3(SUMJ) IC3.4(CMID) IC3.5(NC) IC3.6(NC) IC3.7(2.5V) IC3.9(TEMP) IC3.10(ST2) IC3.11(ST1) IC3.14(CP5) IC3.15(NC) IC3.16(NC) IC3.17(CP3) IC3.18(CP4) IC3.19(CP1) IC3.20(CP2) R11.2 R13.2 R15.2 SV20.5 U6.6(RI#) U6.10(DCD#) U6.19(RESET#) U6.27(OSCI) U6.28(OSCO) U15.P$1(P1_VIN) U15.P$6(P6_VREF) U15.P$9(P9_PWR_DOWN) U15.P$10(P10_SELFTEST) U15.P$12(P12_HIGHPASS_RST)

## Sheet 6 of 6
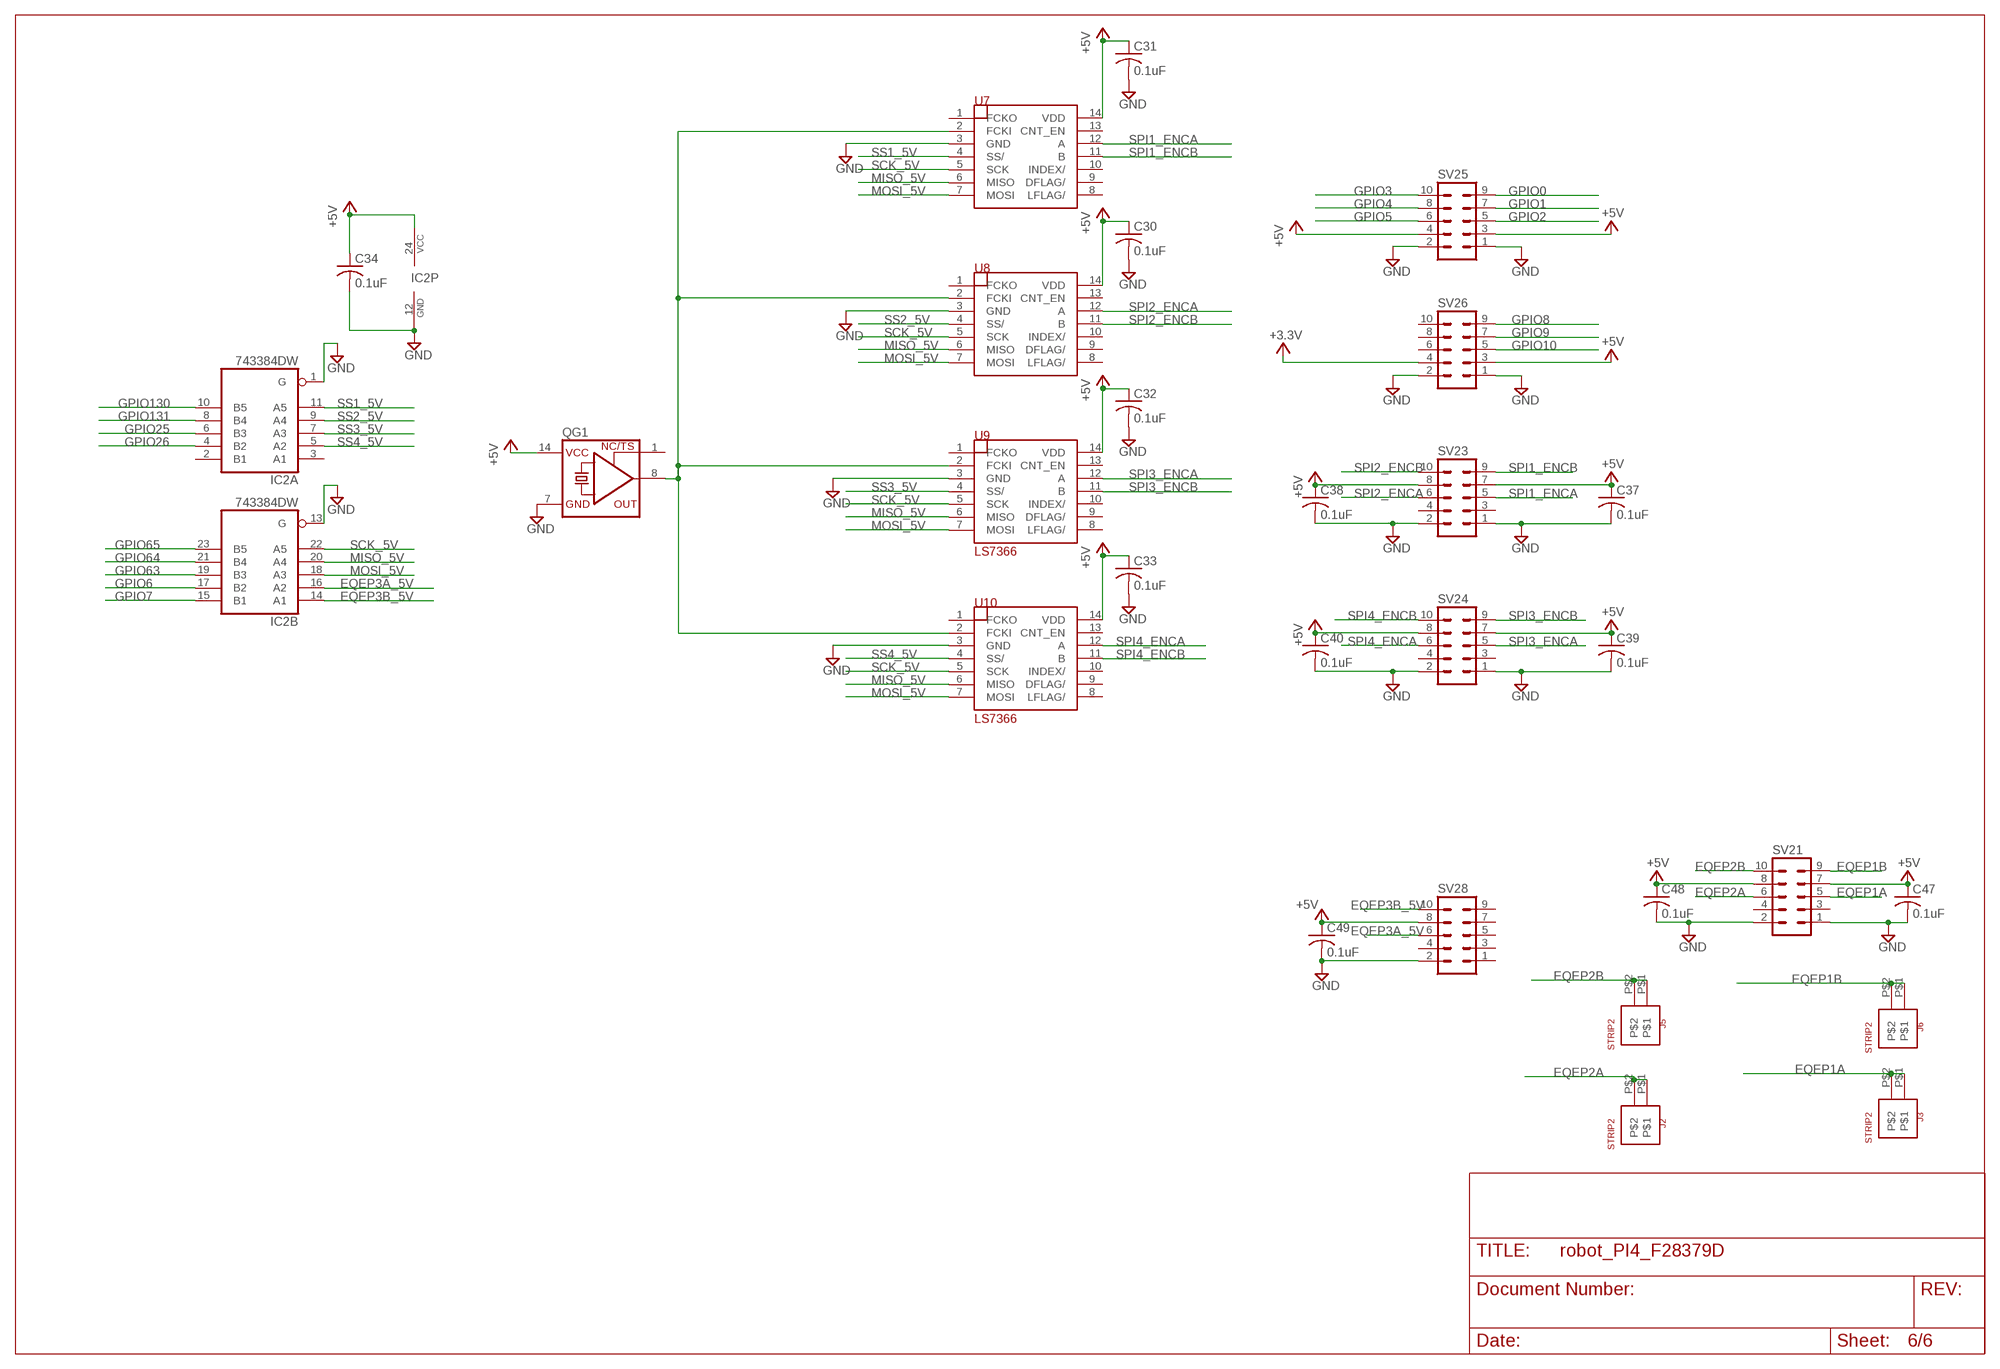
[diagram p5: schematic, sheet 6]

### Parts
C30  0.1uF  C-USC1206  [C1206]
C31  0.1uF  C-USC1206  [C1206]
C32  0.1uF  C-USC1206  [C1206]
C33  0.1uF  C-USC1206  [C1206]
C34  0.1uF  C-USC1206  [C1206]
C37  0.1uF  C-USC1206  [C1206]
C38  0.1uF  C-USC1206  [C1206]
C39  0.1uF  C-USC1206  [C1206]
C40  0.1uF  C-USC1206  [C1206]
C47  0.1uF  C-USC1206  [C1206]
C48  0.1uF  C-USC1206  [C1206]
C49  0.1uF  C-USC1206  [C1206]
IC2  743384DW  [SO24W]
J2  STRIP2  [STRIP2]
J3  STRIP2  [STRIP2]
J5  STRIP2  [STRIP2]
J6  STRIP2  [STRIP2]
QG1  XO-14  [DIL14S]
SV21  MA05-2  [MA05-2]
SV23  MA05-2  [MA05-2]
SV24  MA05-2  [MA05-2]
SV25  MA05-2  [MA05-2]
SV26  MA05-2  [MA05-2]
SV28  MA05-2  [MA05-2]
U7  LS7366R  [SO14]
U8  LS7366R  [SO14]
U9  LS7366  LS7366R  [SO14]
U10  LS7366  LS7366R  [SO14]

### Nets
+3.3V [supply]: SV26.4 ; also sheet 1,2,3,4,5
+5V [supply]: C30.1 C31.1 C32.1 C33.1 C34.1 C37.1 C38.1 C39.1 C40.1 C47.1 C48.1 C49.1 IC2.24(P:VCC) QG1.14(VCC) SV21.7 SV21.8 SV23.7 SV23.8 SV24.7 SV24.8 SV25.3 SV25.4 SV26.3 SV28.8 U7.14(VDD) U8.14(VDD) U9.14(VDD) U10.14(VDD) ; also sheet 1,4,5
EQEP1A: J3.P$1 J3.P$2 SV21.5
EQEP1B: J6.P$1 J6.P$2 SV21.9
EQEP2A: J2.P$1 J2.P$2 SV21.6
EQEP2B: J5.P$1 J5.P$2 SV21.10
EQEP3A_5V: IC2.16(B:A2) SV28.6
EQEP3B_5V: IC2.14(B:A1) SV28.10
GND [supply]: C30.2 C31.2 C32.2 C33.2 C34.2 C37.2 C38.2 C39.2 C40.2 C47.2 C48.2 C49.2 IC2.1(A:G) IC2.12(P:GND) IC2.13(B:G) QG1.7(GND) SV21.1 SV21.2 SV23.1 SV23.2 SV24.1 SV24.2 SV25.1 SV25.2 SV26.1 SV26.2 SV28.2 U7.3(GND) U8.3(GND) U9.3(GND) U10.3(GND) ; also sheet 1,2,3,4,5
GPIO0: SV25.9 ; also sheet 4
GPIO1: SV25.7 ; also sheet 4
GPIO2: SV25.5 ; also sheet 4
GPIO3: SV25.10 ; also sheet 4
GPIO4: SV25.8 ; also sheet 4
GPIO5: SV25.6 ; also sheet 4
GPIO6: IC2.17(B:B2) ; also sheet 4
GPIO7: IC2.15(B:B1) ; also sheet 4
GPIO8: SV26.9 ; also sheet 4
GPIO9: SV26.7 ; also sheet 4
GPIO10: SV26.5 ; also sheet 4
GPIO25: IC2.6(A:B3) ; also sheet 4
GPIO26: IC2.4(A:B2) ; also sheet 4
GPIO63: IC2.19(B:B3) ; also sheet 1,4,5
GPIO64: IC2.21(B:B4) ; also sheet 1,4,5
GPIO65: IC2.23(B:B5) ; also sheet 1,4,5
GPIO130: IC2.10(A:B5) ; also sheet 4
GPIO131: IC2.8(A:B4) ; also sheet 4
MISO_5V: IC2.20(B:A4) U7.6(MISO) U8.6(MISO) U9.6(MISO) U10.6(MISO)
MOSI_5V: IC2.18(B:A3) U7.7(MOSI) U8.7(MOSI) U9.7(MOSI) U10.7(MOSI)
N$56: QG1.8(OUT) U7.2(FCKI) U8.2(FCKI) U9.2(FCKI) U10.2(FCKI)
SCK_5V: IC2.22(B:A5) U7.5(SCK) U8.5(SCK) U9.5(SCK) U10.5(SCK)
SPI1_ENCA: SV23.5 U7.12(A)
SPI1_ENCB: SV23.9 U7.11(B)
SPI2_ENCA: SV23.6 U8.12(A)
SPI2_ENCB: SV23.10 U8.11(B)
SPI3_ENCA: SV24.5 U9.12(A)
SPI3_ENCB: SV24.9 U9.11(B)
SPI4_ENCA: SV24.6 U10.12(A)
SPI4_ENCB: SV24.10 U10.11(B)
SS1_5V: IC2.11(A:A5) U7.4(SS/)
SS2_5V: IC2.9(A:A4) U8.4(SS/)
SS3_5V: IC2.7(A:A3) U9.4(SS/)
SS4_5V: IC2.5(A:A2) U10.4(SS/)
Unconnected: IC2.2(A:B1) IC2.3(A:A1) QG1.1(TS) SV21.3 SV21.4 SV23.3 SV23.4 SV24.3 SV24.4 SV26.6 SV26.8 SV26.10 SV28.1 SV28.3 SV28.4 SV28.5 SV28.7 SV28.9 U7.1(FCKO) U7.8(LFLAG/) U7.9(DFLAG/) U7.10(INDEX/) U7.13(CNT_EN) U8.1(FCKO) U8.8(LFLAG/) U8.9(DFLAG/) U8.10(INDEX/) U8.13(CNT_EN) U9.1(FCKO) U9.8(LFLAG/) U9.9(DFLAG/) U9.10(INDEX/) U9.13(CNT_EN) U10.1(FCKO) U10.8(LFLAG/) U10.9(DFLAG/) U10.10(INDEX/) U10.13(CNT_EN)

## Library data of the parts
B1 = SE423EagleLibrary:BUZZER
B3-B5 = custom:BANANA_MALE
C4-C34 C37-C40 C47-C49 = rcl:C-US: CAPACITOR, American symbol
ETH1 = wiznet:USR_ES1_W5500
IC2 = 74xx-us:74*3384: 10-bit FET bus switches with level shifting
IC3 = analog-devices:ADXRS300EB
IC4 = 74xx-us:74*04: Hex INVERTER
J1-J3 J5-J7 J9 J11-J13 J22 J35-J38 J66-J69 J204-J207 = strip:STRIP2
J10 J14-J21 J28-J33 J98-J170 J176 J177 = strip:STRIP3
L1 = SE423EagleLibrary:F28379D_LAUNCHPAD
L2 = rcl:L-US: INDUCTOR, American symbol
LED1-LED6 LED17 LED_RX1 LED_TX1 USB_PWR1 = led:LED: LED OSRAM: - CHIPLED LG R971, LG N971, LY N971, LG Q971, LY Q971, LO R971, LY R971 LH N974, LH R974 LS Q976, LO Q976, LY Q976 LO Q996 - Hyper CHIPLED LW Q18S LB Q993, LB Q99A, LB R99A - SideLED LS A670, LO A670, LY A670, LG A670, LP A670 LB A673, LV A673, LT A673, LW A673 LH A674 LY A675 LS A676, LA A676, LO A676, LY A676, LW A676 LS A679, LY A679, LG A679 - Hyper Micro SIDELED® LS Y876, LA Y876, LO Y876, LY Y876 LT Y87S - SmartLED LW L88C, LW L88S LB L89C, LB L89S, LG L890 LS L89K, LO L89K, LY L89K LS L896, LA L896, LO L896, LY L896 - TOPLED LS T670, LO T670, LY T670, LG T670, LP T670 LSG T670, LSP T670, LSY T670, LOP T670, LYG T670 LG T671, LOG T671, LSG T671 LB T673, LV T673, LT T673, LW T673 LH T674 LS T676, LA T676, LO T676, LY T676, LB T676, LH T676, LSB T676, LW T676 LB T67C, LV T67C, LT T67C, LS T67K, LO T67K, LY T67K, LW E67C LS E67B, LA E67B, LO E67B, LY E67B, LB E67C, LV E67C, LT E67C LW T67C LS T679, LY T679, LG T679 LS T770, LO T770, LY T770, LG T770, LP T770 LB T773, LV T773, LT T773, LW T773 LH T774 LS E675, LA E675, LY E675, LS T675 LS T776, LA T776, LO T776, LY T776, LB T776 LHGB T686 LT T68C, LB T68C - Hyper Mini TOPLED® LB M676 - Mini TOPLED Santana® LG M470 LS M47K, LO M47K, LY M47K Source: http://www.osram.convergy.de LUXEON: - LUMILED® LXK2-PW12-R00, LXK2-PW12-S00, LXK2-PW14-U00, LXK2-PW14-V00 LXK2-PM12-R00, LXK2-PM12-S00, LXK2-PM14-U00 LXK2-PE12-Q00, LXK2-PE12-R00, LXK2-PE12-S00, LXK2-PE14-T00, LXK2-PE14-U00 LXK2-PB12-K00, LXK2-PB12-L00, LXK2-PB12-M00, LXK2-PB14-N00, LXK2-PB14-P00, LXK2-PB14-Q00 LXK2-PR12-L00, LXK2-PR12-M00, LXK2-PR14-Q00, LXK2-PR14-R00 LXK2-PD12-Q00, LXK2-PD12-R00, LXK2-PD12-S00 LXK2-PH12-R00, LXK2-PH12-S00 LXK2-PL12-P00, LXK2-PL12-Q00, LXK2-PL12-R00 Source: www.luxeon.com KINGBRIGHT: KA-3528ASYC Source: www.kingbright.com
P1 = custom:TH_PUSHBOTTON
P2 P3 = custom7:MOLEX_POWER
QG1 = crystal:XO-: CRYSTAL
R1-R25 R30-R38 = rcl:R-US_: RESISTOR, American symbol
SV1 SV3 SV6 SV16-SV18 SV20 SV21 SV23-SV26 SV28 = con-lstb:MA05-2: PIN HEADER; OC_FARNELL: unknown; OC_NEWARK: unknown
SV2 SV5 = con-lstb:MA20-2: PIN HEADER; OC_FARNELL: unknown; OC_NEWARK: unknown
SV4 SV15 SV22 SV27 = con-lstb:MA07-2: PIN HEADER; OC_FARNELL: unknown; OC_NEWARK: unknown
SV7 SV11 SV41 = con-lstb:MA06-2: PIN HEADER; OC_FARNELL: unknown; OC_NEWARK: unknown
SV8-SV10 SV12 SV19 SV30 = con-lstb:MA05-1: PIN HEADER; OC_FARNELL: unknown; OC_NEWARK: unknown
SV13 SV14 SV64-SV71 = con-lstb:MA03-1: PIN HEADER; OC_FARNELL: unknown; OC_NEWARK: unknown
SV45 SV75 = con-lstb:MA03-2: PIN HEADER; OC_FARNELL: unknown; OC_NEWARK: unknown
SV53-SV58 = con-lstb:MA10-1: PIN HEADER; OC_FARNELL: unknown; OC_NEWARK: unknown
U2 U4 = custom:MAX3232IDWR
U3 = custom6:IS62WVS512
U5 = custom5:MAX4506-SOIC8
U6 = ftdichip-3:FT232RL: USB UART 4th Generation USB UART (USB <-> Serial) Controller
U7-U10 = custom2:LS7366R
U11 = custom6:TMS320F28027DAS
U12 = custom4:TL1963A-33KTTR
U15 = custom2:POLOLU_LPR510AL
U$1 = MPU-9250_Breakoutboard:MPU-9250-BB
X1 = con-subd:M09HP: SUB-D
X2 = con-usb-3:USB: USB Connectors

## Net classes
0 default: width 0.203 mm, drill 0.508 mm, clearance 0.203 mm
1 supply: width 1.27 mm, drill 0.508 mm, clearance 0.203 mm